# EAGLE schematic H-API_Sequencer (EAGLE 9.1.3)
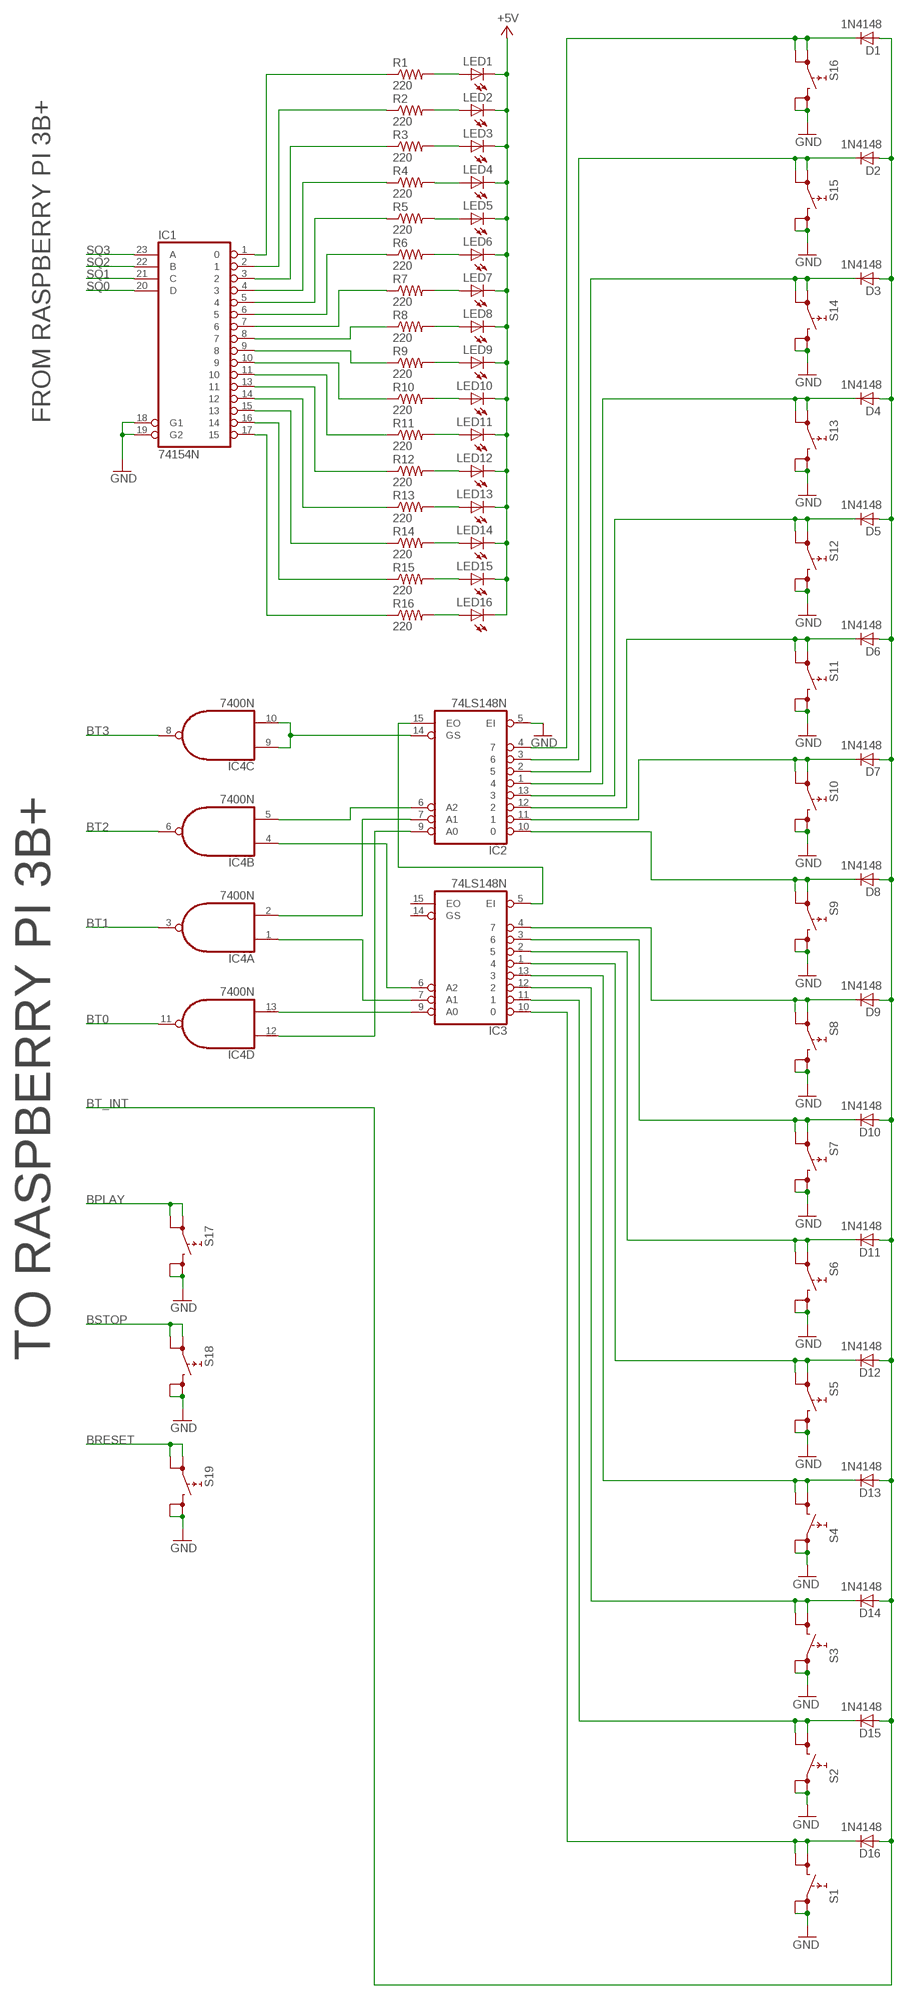
[diagram p0: schematic, sheet 1]

## Parts
IC1  74154N  [DIL24-6]
IC2  74LS148N  [DIL16]
IC3  74LS148N  [DIL16]
IC4  7400N  [DIL14]
LED1  LED5MM  [LED5MM]
LED2  LED5MM  [LED5MM]
LED3  LED5MM  [LED5MM]
LED4  LED5MM  [LED5MM]
LED5  LED5MM  [LED5MM]
LED6  LED5MM  [LED5MM]
LED7  LED5MM  [LED5MM]
LED8  LED5MM  [LED5MM]
LED9  LED5MM  [LED5MM]
LED10  LED5MM  [LED5MM]
LED11  LED5MM  [LED5MM]
LED12  LED5MM  [LED5MM]
LED13  LED5MM  [LED5MM]
LED14  LED5MM  [LED5MM]
LED15  LED5MM  [LED5MM]
LED16  LED5MM  [LED5MM]
R1  220  R-US_VMTA55  [VMTA55]
R2  220  R-US_VMTA55  [VMTA55]
R3  220  R-US_VMTA55  [VMTA55]
R4  220  R-US_VMTA55  [VMTA55]
R5  220  R-US_VMTA55  [VMTA55]
R6  220  R-US_VMTA55  [VMTA55]
R7  220  R-US_VMTA55  [VMTA55]
R8  220  R-US_VMTA55  [VMTA55]
R9  220  R-US_VMTA55  [VMTA55]
R10  220  R-US_VMTA55  [VMTA55]
R11  220  R-US_VMTA55  [VMTA55]
R12  220  R-US_VMTA55  [VMTA55]
R13  220  R-US_VMTA55  [VMTA55]
R14  220  R-US_VMTA55  [VMTA55]
R15  220  R-US_VMTA55  [VMTA55]
R16  220  R-US_VMTA55  [VMTA55]
S1  REKN  [REKN]
S2  REKN  [REKN]
S3  REKN  [REKN]
S4  REKN  [REKN]
S5  REKN  [REKN]
S6  REKN  [REKN]
S7  REKN  [REKN]
S8  REKN  [REKN]
S9  REKN  [REKN]
S10  REKN  [REKN]
S11  REKN  [REKN]
S12  REKN  [REKN]
S13  REKN  [REKN]
S14  REKN  [REKN]
S15  REKN  [REKN]
S16  REKN  [REKN]
S17  REKN  [REKN]
S18  REKN  [REKN]
S19  REKN  [REKN]

## Nets
+5V: LED1.K(C) LED2.K(C) LED3.K(C) LED4.K(C) LED5.K(C) LED6.K(C) LED7.K(C) LED8.K(C) LED9.K(C) LED10.K(C) LED11.K(C) LED12.K(C) LED13.K(C) LED14.K(C) LED15.K(C) LED16.K(C)
BPLAY: S17.0A S17.0B
BRESET: S19.0A S19.0B
BSTOP: S18.0A S18.0B
BT0: IC4.11(D:O)
BT1: IC4.3(A:O)
BT2: IC4.6(B:O)
BT3: IC4.8(C:O)
GND: IC1.18(G1) IC1.19(G2) IC2.5(EI) S1.0A S1.0B S2.0A S2.0B S3.0A S3.0B S4.0A S4.0B S5.1A S5.1B S6.1A S6.1B S7.1A S7.1B S8.1A S8.1B S9.1A S9.1B S10.1A S10.1B S11.1A S11.1B S12.1A S12.1B S13.1A S13.1B S14.1A S14.1B S15.1A S15.1B S16.1A S16.1B S17.1A S17.1B S18.1A S18.1B S19.1A S19.1B
N$1: LED1.A R1.2
N$2: LED2.A R2.2
N$3: LED3.A R3.2
N$4: IC1.4 R4.1
N$5: LED5.A R5.2
N$6: LED6.A R6.2
N$7: LED7.A R7.2
N$8: LED8.A R8.2
N$9: LED9.A R9.2
N$10: LED10.A R10.2
N$11: LED11.A R11.2
N$12: LED12.A R12.2
N$13: LED13.A R13.2
N$14: LED14.A R14.2
N$15: LED15.A R15.2
N$16: LED16.A R16.2
N$17: IC1.1 R1.1
N$18: IC1.2 R2.1
N$19: IC1.3 R3.1
N$20: LED4.A R4.2
N$21: IC1.5 R5.1
N$22: IC1.6 R6.1
N$23: IC1.7 R7.1
N$24: IC1.8 R8.1
N$25: IC1.9 R9.1
N$26: IC1.10 R10.1
N$27: IC1.11 R11.1
N$28: IC1.13 R12.1
N$29: IC1.14 R13.1
N$30: IC1.15 R14.1
N$31: IC1.16 R15.1
N$32: IC1.17 R16.1
N$33: IC2.15(EO) IC3.5(EI)
N$34: IC2.4 S16.0A S16.0B
N$35: IC2.3 S15.0A S15.0B
N$36: IC2.2 S14.0A S14.0B
N$37: IC2.13 S12.0A S12.0B
N$38: IC2.1 S13.0A S13.0B
N$39: IC2.12 S11.0A S11.0B
N$40: IC2.11 S10.0A S10.0B
N$41: IC2.10 S9.0A S9.0B
N$42: IC3.4 S8.0A S8.0B
N$43: IC3.3 S7.0A S7.0B
N$44: IC3.2 S6.0A S6.0B
N$45: IC3.1 S5.0A S5.0B
N$46: IC3.13 S4.1A S4.1B
N$47: IC3.12 S3.1A S3.1B
N$48: IC3.11 S2.1A S2.1B
N$49: IC3.10 S1.1A S1.1B
N$50: IC2.14(GS) IC4.9(C:I0) IC4.10(C:I1)
N$51: IC2.7(A1) IC4.2(A:I1)
N$52: IC3.7(A1) IC4.1(A:I0)
N$53: IC3.6(A2) IC4.4(B:I0)
N$54: IC2.6(A2) IC4.5(B:I1)
N$55: IC3.9(A0) IC4.13(D:I1)
N$56: IC2.9(A0) IC4.12(D:I0)
SQ0: IC1.20(D)
SQ1: IC1.21(C)
SQ2: IC1.22(B)
SQ3: IC1.23(A)
Unconnected: IC3.14(GS) IC3.15(EO)

## Notes on the sheet
- FROM RASPBERRY PI 3B+
- TO RASPBERRY PI 3B+

## Power pins joined to a net without a drawn wire
GND: IC1.12(GND) IC2.8(GND) IC3.8(GND) IC4.7(P:GND)
VCC: IC1.24(VCC) IC2.16(VCC) IC3.16(VCC) IC4.14(P:VCC)

## Library data of the parts
IC1 = 74xx-us:74*154: 4-line to 16-line data SELECTOR/MULTIPLEXER
IC2 IC3 = 74xx-us:74*148: 10-line to 4-line and 8-line to 3-line PRIORITY ENCODER
IC4 = 74xx-us:74*00: Quad 2-input NAND gate
LED1-LED16 = led:LED: LED OSRAM: - CHIPLED LG R971, LG N971, LY N971, LG Q971, LY Q971, LO R971, LY R971 LH N974, LH R974 LS Q976, LO Q976, LY Q976 LO Q996 - Hyper CHIPLED LW Q18S LB Q993, LB Q99A, LB R99A - SideLED LS A670, LO A670, LY A670, LG A670, LP A670 LB A673, LV A673, LT A673, LW A673 LH A674 LY A675 LS A676, LA A676, LO A676, LY A676, LW A676 LS A679, LY A679, LG A679 - Hyper Micro SIDELED® LS Y876, LA Y876, LO Y876, LY Y876 LT Y87S - SmartLED LW L88C, LW L88S LB L89C, LB L89S, LG L890 LS L89K, LO L89K, LY L89K LS L896, LA L896, LO L896, LY L896 - TOPLED LS T670, LO T670, LY T670, LG T670, LP T670 LSG T670, LSP T670, LSY T670, LOP T670, LYG T670 LG T671, LOG T671, LSG T671 LB T673, LV T673, LT T673, LW T673 LH T674 LS T676, LA T676, LO T676, LY T676, LB T676, LH T676, LSB T676, LW T676 LB T67C, LV T67C, LT T67C, LS T67K, LO T67K, LY T67K, LW E67C LS E67B, LA E67B, LO E67B, LY E67B, LB E67C, LV E67C, LT E67C LW T67C LS T679, LY T679, LG T679 LS T770, LO T770, LY T770, LG T770, LP T770 LB T773, LV T773, LT T773, LW T773 LH T774 LS E675, LA E675, LY E675, LS T675 LS T776, LA T776, LO T776, LY T776, LB T776 LHGB T686 LT T68C, LB T68C - Hyper Mini TOPLED® LB M676 - Mini TOPLED Santana® LG M470 LS M47K, LO M47K, LY M47K Source: http://www.osram.convergy.de LUXEON: - LUMILED® LXK2-PW12-R00, LXK2-PW12-S00, LXK2-PW14-U00, LXK2-PW14-V00 LXK2-PM12-R00, LXK2-PM12-S00, LXK2-PM14-U00 LXK2-PE12-Q00, LXK2-PE12-R00, LXK2-PE12-S00, LXK2-PE14-T00, LXK2-PE14-U00 LXK2-PB12-K00, LXK2-PB12-L00, LXK2-PB12-M00, LXK2-PB14-N00, LXK2-PB14-P00, LXK2-PB14-Q00 LXK2-PR12-L00, LXK2-PR12-M00, LXK2-PR14-Q00, LXK2-PR14-R00 LXK2-PD12-Q00, LXK2-PD12-R00, LXK2-PD12-S00 LXK2-PH12-R00, LXK2-PH12-S00 LXK2-PL12-P00, LXK2-PL12-Q00, LXK2-PL12-R00 Source: www.luxeon.com KINGBRIGHT: KA-3528ASYC Source: www.kingbright.com
R1-R16 = rcl:R-US_: RESISTOR, American symbol; SPICEPREFIX: R
S1-S19 = switch:REKN: PUSH SWITCH ITT-Cannon-Cannon